# EAGLE design Grove - IMU 9DOF v2.0 (EAGLE 6.4)

## Sheet 1 of 2
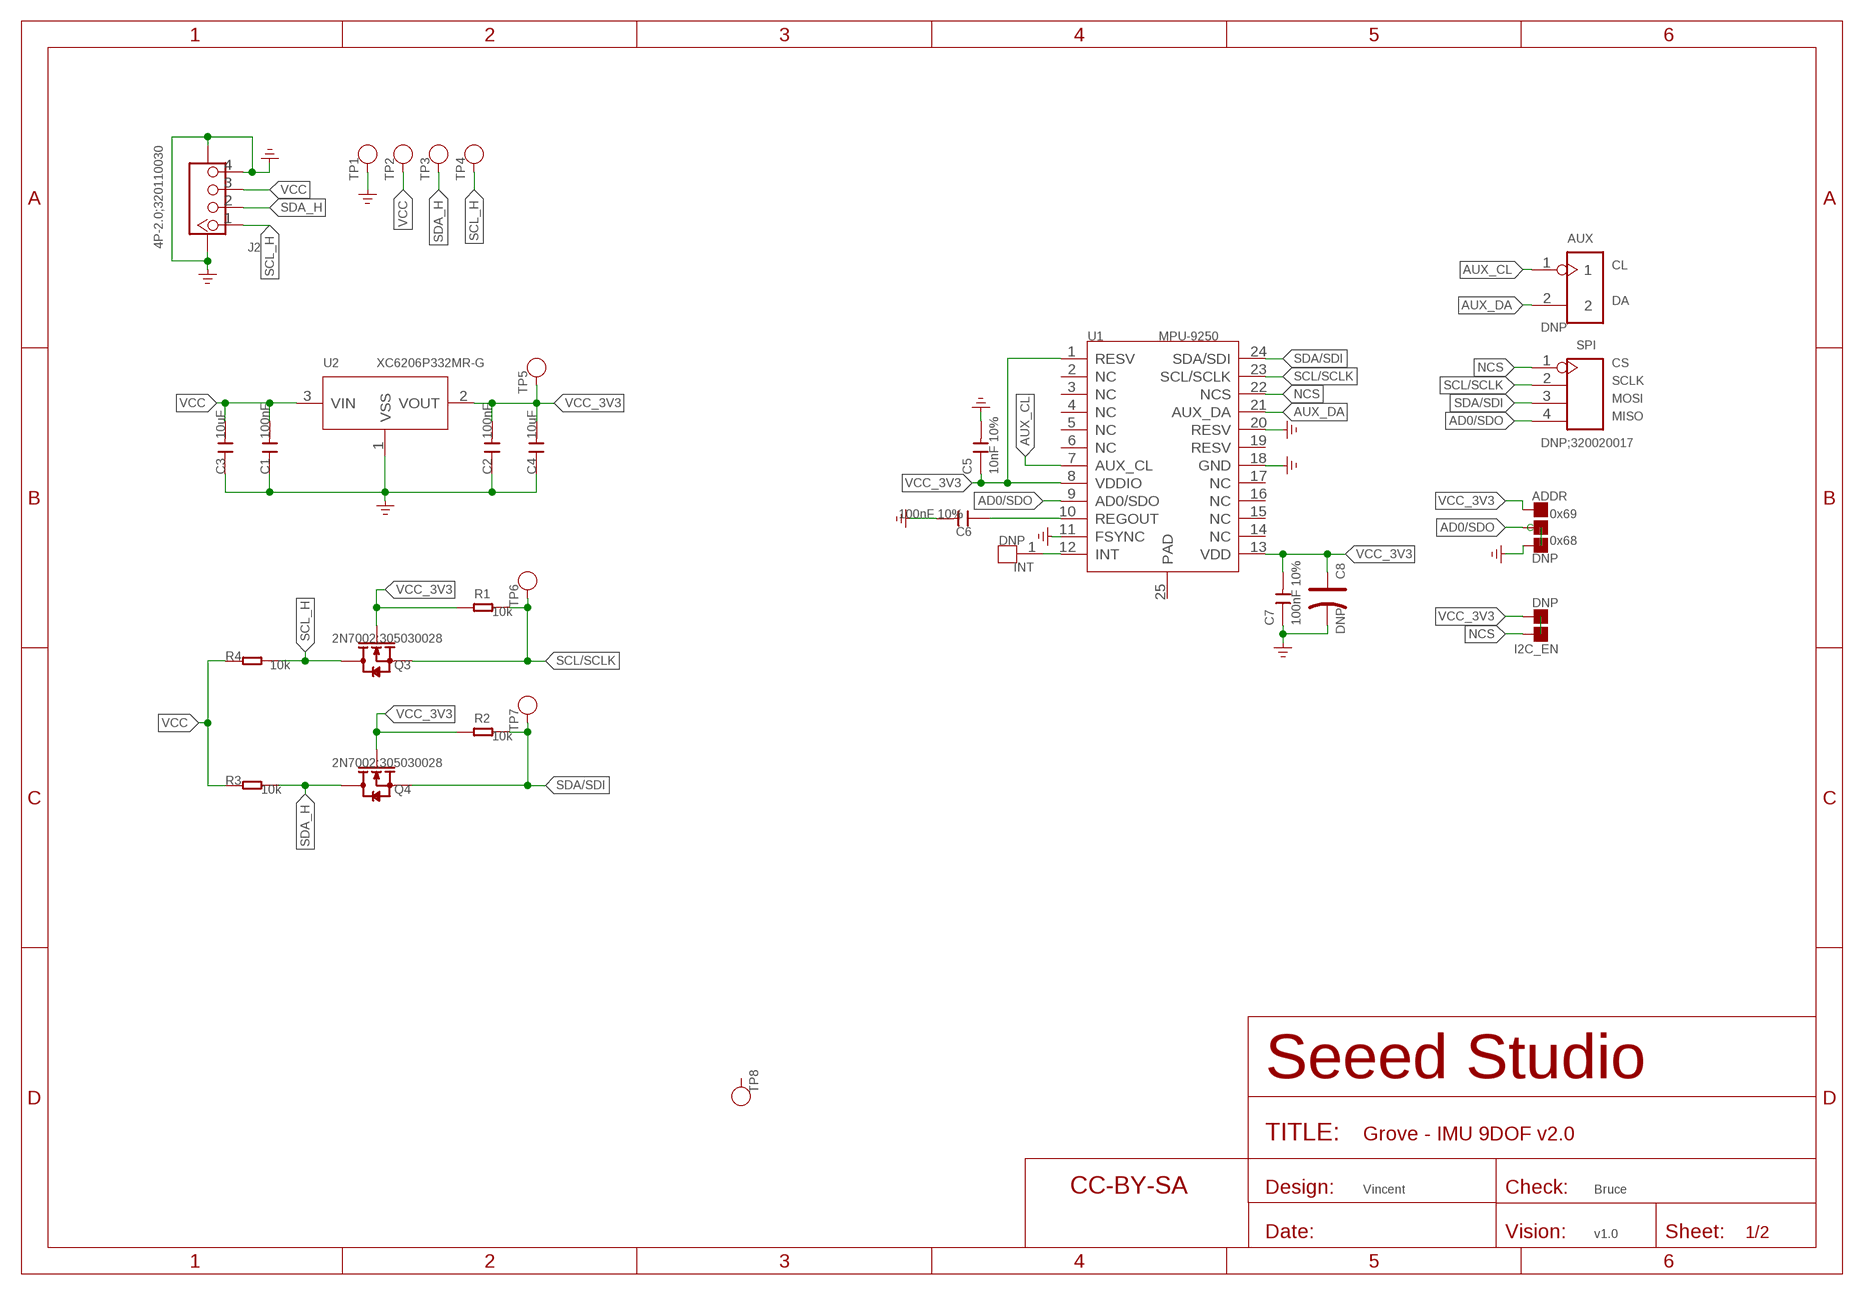
[diagram p0: schematic, sheet 1]

### Parts
ADDR  DNP  PAD-JUMPER-3P-40*40  [3P-SMD-L4.1*W1.5MM]
AUX  DNP  HEADER-2P-65/35MIL  [2P-2.54-65/35MIL]
C1  100nF  CAP-0603  [C0603]
C2  100nF  CAP-0603  [C0603]
C3  10uF  CAP-0805  [C0805]
C4  10uF  CAP-0805  [C0805]
C5  10nF 10%  CAP-0603  [C0603]
C6  100nF 10%  CAP-0603  [C0603]
C7  100nF 10%  CAP-0603  [C0603]
C8  DNP  CAP-POLAR-AVX-A  [AVX-A]
I2C_EN  DNP  PAD-JUMPER-2P  [2P-SMD-L1.78*W1.27MM]
INT  DNP  HEADER-1P-35  [1P-65/35MIL]
J2  4P-2.0;320110030  GROVE-CONNECTOR-SMD'DD'  [4P-SMD-2.0]
Q3  2N7002;305030028  MOSFET-N'SOT23'  [SOT-23]
Q4  2N7002;305030028  MOSFET-N'SOT23'  [SOT-23]
R1  10k  RES-0603  [R0603]
R2  10k  RES-0603  [R0603]
R3  10k  RES-0603  [R0603]
R4  10k  RES-0603  [R0603]
SPI  DNP;320020017  HEADER-4P-65/35MIL  [4P-2.54-65/35MIL]
TP1  DNP  PAD-TEST-POINT'4545'  [TP-D45MIL]
TP2  DNP  PAD-TEST-POINT'4545'  [TP-D45MIL]
TP3  DNP  PAD-TEST-POINT'4545'  [TP-D45MIL]
TP4  DNP  PAD-TEST-POINT'4545'  [TP-D45MIL]
TP5  DNP  PAD-TEST-POINT'4545'  [TP-D45MIL]
TP6  DNP  PAD-TEST-POINT'4545'  [TP-D45MIL]
TP7  DNP  PAD-TEST-POINT'4545'  [TP-D45MIL]
TP8  DNP  PAD-TEST-POINT'4545'  [TP-D45MIL]
U1  MPU-9250  [LEAD-QFN24]
U2  XC6206P332MR-G  PMIC-XC6206PMR  [SOT-23]
U$1  SEEEDSTUDIO-OPEN-SCH-FRAME  [SEEEDSTUDIO-PCB-FRAME]

### Nets
AD0/SDO: ADDR.MM(C) SPI.4 U1.9(AD0/SDO)
AUX_CL: AUX.1 U1.7(AUX_CL)
AUX_DA: AUX.2 U1.21(AUX_DA)
GND: ADDR.11(R) C1.1 C2.1 C3.1 C4.1 C5.2 C6.2 C7.1 C8.- J2.4 J2.SS1 J2.SS2 TP1.T U1.11(FSYNC) U1.18(GND) U1.20(RESV) U2.1(VSS) ; supply symbol labelled GND_POWER
N$3: C6.1 U1.10(REGOUT)
N$4: INT.1 U1.12(INT)
NCS: I2C_EN.2 SPI.1 U1.22(NCS)
SCL/SCLK: Q3.2(S) R1.2 SPI.2 TP6.T U1.23(SCL/SCLK)
SCL_H: J2.1 Q3.3(D) R4.2 TP4.T
SDA/SDI: Q4.2(S) R2.2 SPI.3 TP7.T U1.24(SDA/SDI)
SDA_H: J2.2 Q4.3(D) R3.2 TP3.T
VCC: C1.2 C3.2 J2.3 R3.1 R4.1 TP2.T U2.3(VIN)
VCC_3V3: ADDR.00(L) C2.2 C4.2 C5.1 C7.2 C8.+ I2C_EN.1 Q3.1(G) Q4.1(G) R1.1 R2.1 TP5.T U1.1(RESV) U1.8(VDDIO) U1.13(VDD) U2.2(VOUT)
Unconnected: TP8.T U1.2(NC) U1.3(NC) U1.4(NC) U1.5(NC) U1.6(NC) U1.14(NC) U1.15(NC) U1.16(NC) U1.17(NC) U1.19(RESV) U1.25(PAD)

### Notes on the sheet
- CL
- DA
- CS
- SCLK
- MOSI
- MISO
- 0x69
- 0x68
- Vincent | Bruce
- v1.0

## Sheet 2 of 2

## Library data of the parts
ADDR = Discrete-new:PAD-JUMPER-3P; PARTNO: DNP
AUX = Connector-new:HEADER-2P
C1-C7 = Discrete-new:CAP: Ceramic Capacitors
C8 = Discrete-new:CAP-POLAR: Electrolytic Capacitors,Tantalum Capacitors and Super Capacitors
I2C_EN = Discrete-new:PAD-JUMPER-2P; PARTNO: DNP
INT = Connector-new:HEADER-1P
J2 = Connector-new:GROVE-CONNECTOR-SMD: 4P-SMD-2.0:320110030;4P-SMD-2.0-90D:320110032
Q3 Q4 = Discrete-new:MOSFET-N: IRLL014: http://www.vishay.com/docs/91319/sihll014.pdf
R1-R4 = Discrete-new:RES
SPI = Connector-new:HEADER-4P
TP1-TP8 = Discrete-new:PAD-TEST-POINT; PARTNO: DNP
U1 = template:MPU-9250
U2 = IC-new:PMIC-XC6206P: LOW ESR Cap.Compatible Positive Voltage Regulators
U$1 = moudle-new:SEEEDSTUDIO-OPEN-SCH-FRAME

## Board
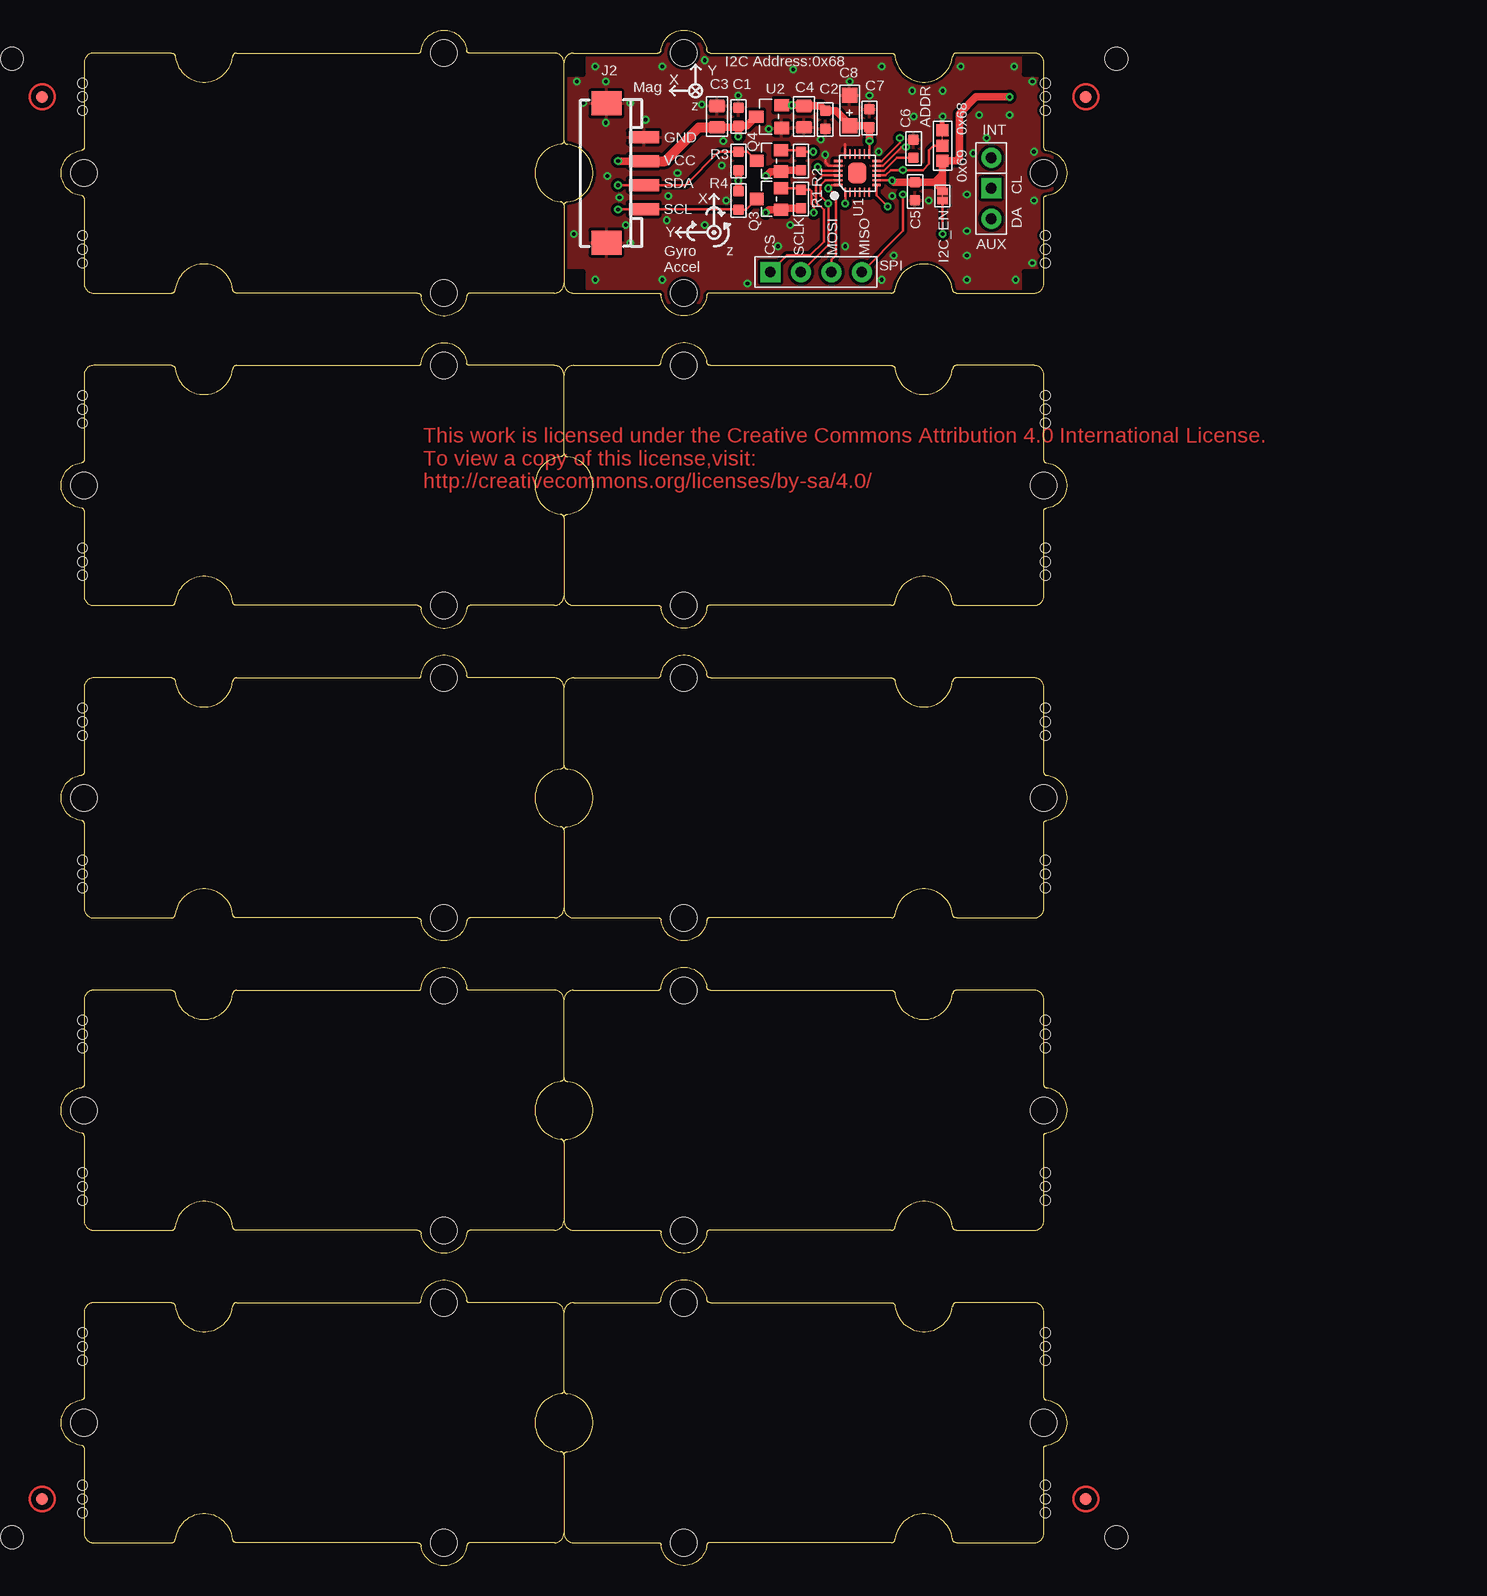
[diagram p1: board, top side]
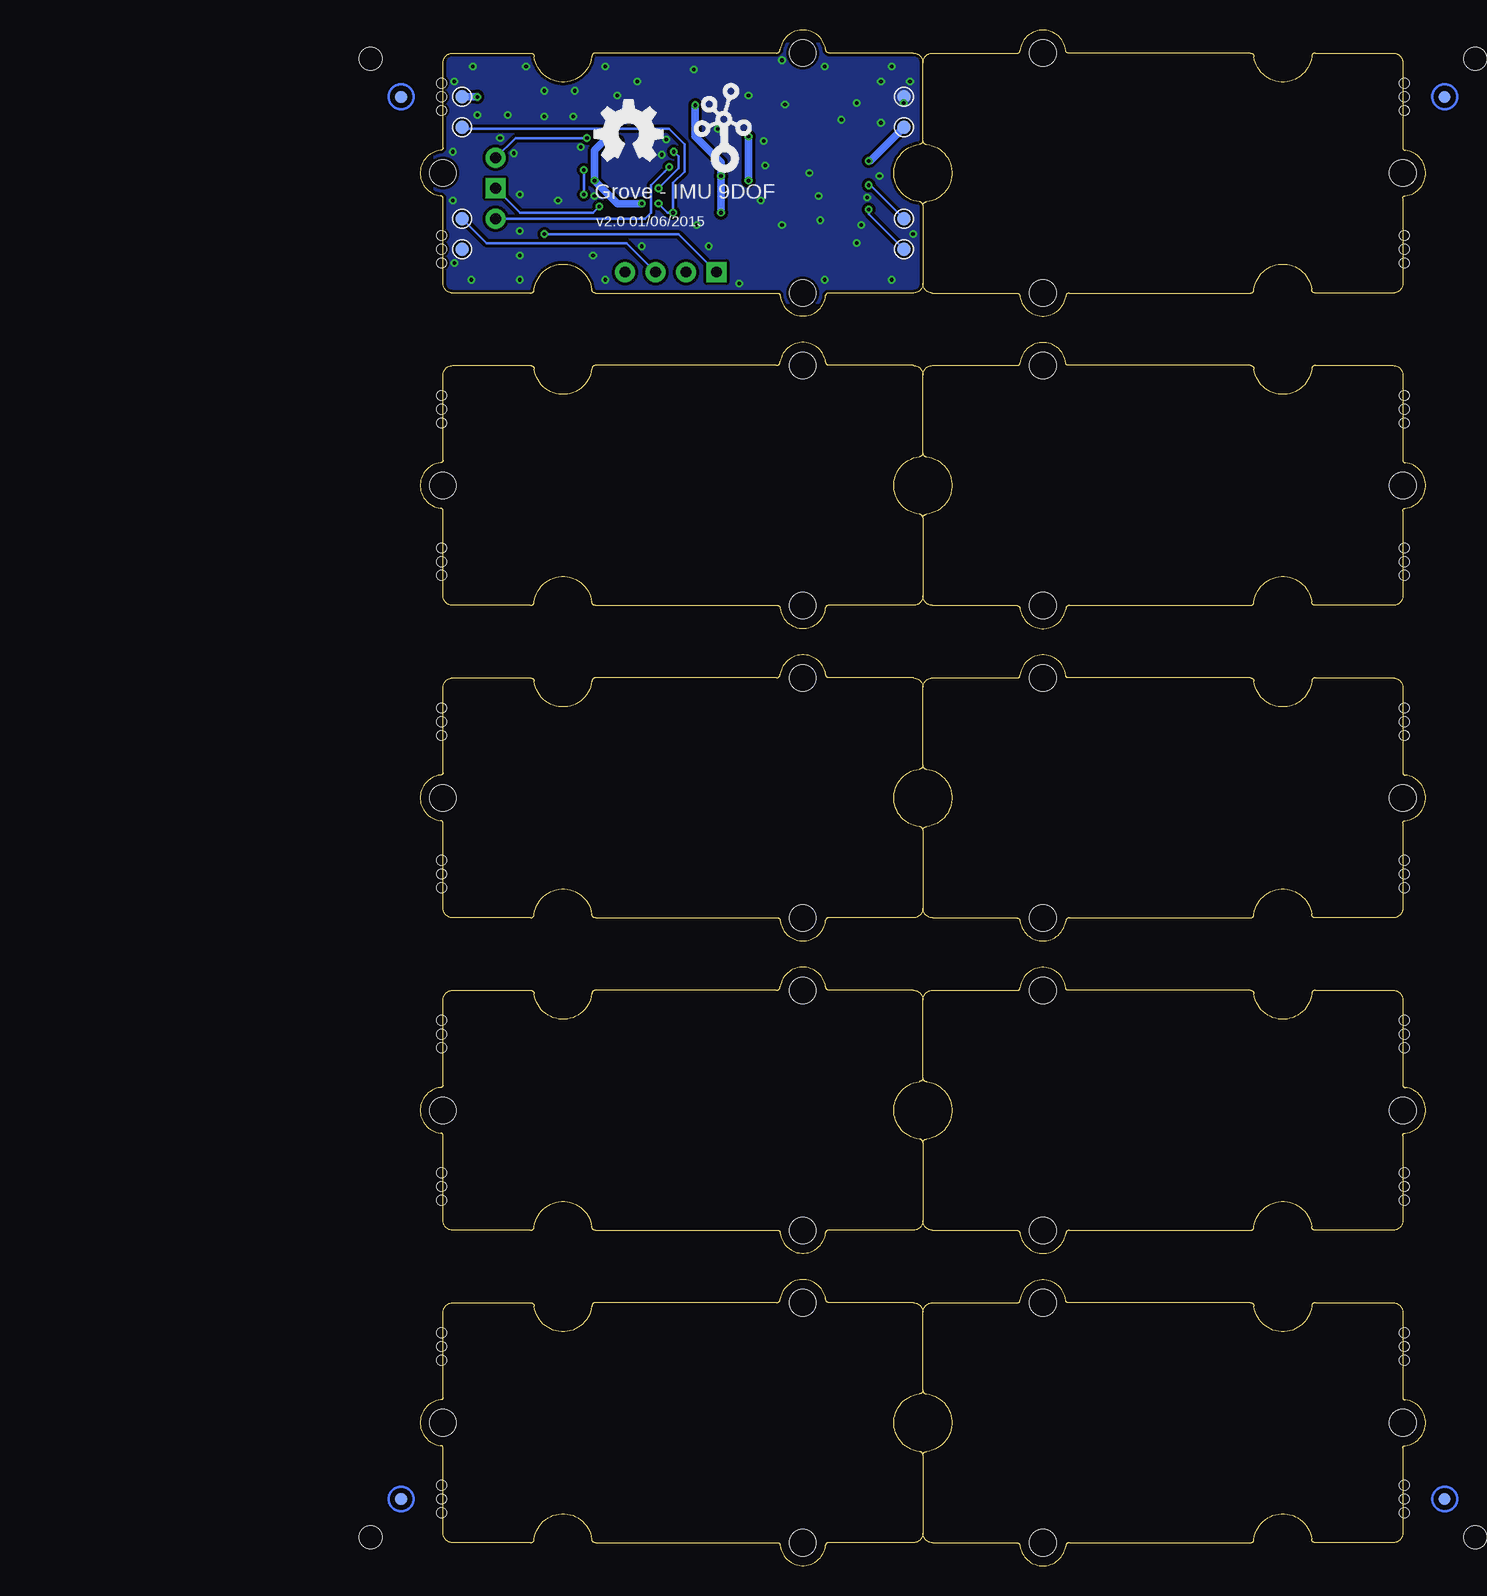
[diagram p2: board, bottom side, seen from below]

Size 83.82 x 127.98 mm. Coordinates in mm from the lower left corner, seen from the top.
Copper layers (1*16): Top 0.035mm / dielectric 1.5mm / Bottom 0.035mm
Design rules "SeeedStudio_2layer_DRU_no_angle_20140221 *": minimum track width 4mil, minimum drill 12mil, track to track 6mil, track to pad 6mil, pad to pad 6mil, via to via 6mil, smd to smd 0mil, copper to edge 10mil, drill to drill 10mil, minimum pad ring 10mil, minimum via ring 6mil, stop-mask expansion 2mil, vias tented up to drill 25mil, thermal gap 10mil
Holes 0.8 mm at 1.78,123.55 1.78,121.27 1.78,122.41 1.78,110.85 1.78,108.57 1.78,109.71 1.78,97.52 1.78,95.23 1.78,96.38 1.78,84.82 1.78,82.53 1.78,83.68 1.78,71.48 1.78,69.2 1.78,70.34 1.78,58.78 1.78,56.5 1.78,57.64 1.78,45.45 1.78,43.16 1.78,44.31 1.78,32.75 1.78,30.46 1.78,31.61 1.78,19.41 1.78,17.13 1.78,18.27 1.78,6.71 1.78,4.43 1.78,5.57 82.04,121.27 82.04,123.55 82.04,122.41 82.04,108.57 82.04,110.85 82.04,109.71 82.04,95.23 82.04,97.52 82.04,96.38 82.04,82.53 82.04,84.82 82.04,83.68 82.04,69.2 82.04,71.48 82.04,70.34 82.04,56.5 82.04,58.78 82.04,57.64 82.04,43.16 82.04,45.45 82.04,44.31 82.04,30.46 82.04,32.75 82.04,31.61 82.04,17.13 82.04,19.41 82.04,18.27 82.04,4.43 82.04,6.71 82.04,5.57
Holes 1.91 mm at -4.13,2.4 87.95,2.4 87.95,125.59 -4.13,125.59

### Footprints (pad centres in the part's own frame; a part is rotated, then mirrored left to right if it is on the bottom)
3P-SMD-L4.1*W1.5MM = smd 1.016 x 1.016: 00 -1.27,0; 11 1.27,0; MM 0,0
2P-2.54-65/35MIL = drill 0.889 pad 1.651 square: 1 0,1.27 | drill 0.889 pad 1.651: 2 0,-1.27
C0603 = smd 0.889 x 0.889: 1 0,0.762; 2 0,-0.762
C0805 = smd 1.397 x 1.016: 1 0,0.889; 2 0,-0.889
AVX-A = smd 1.27 x 1.27: + -1.27,0; - 1.27,0
2P-SMD-L1.78*W1.27MM = smd 0.889 x 0.61: 1 0,0.381; 2 0,-0.381
1P-65/35MIL = drill 0.889 pad 1.651: 1 0,0
4P-SMD-2.0 = smd 1 x 2.5: 1 -3,0; 2 -1,0; 3 1,0; 4 3,0 | smd 2 x 2.5: SS1 -5.8,3.123; SS2 5.8,3.123
ROUND-MARK-1.0 = smd 1.016 x 1.016: P$1 0,0
SOT-23 = smd 1.016 x 1.143: 1 -0.889,-1.016; 2 0.889,-1.016; 3 0,1.016
R0603 = smd 0.889 x 0.889: 1 0,0.762; 2 0,-0.762
4P-2.54-65/35MIL = drill 0.889 pad 1.651 square: 1 0,3.81 | drill 0.889 pad 1.651: 2 0,1.27; 3 0,-1.27; 4 0,-3.81
TP-D45MIL = smd 1.143 x 1.143: T 0,0
LEAD-QFN24 = smd 0.8 x 0.2: 1 -1.6,1; 2 -1.6,0.6; 3 -1.6,0.2; 4 -1.6,-0.2; 5 -1.6,-0.6; 6 -1.6,-1; 13 1.6,-1; 14 1.6,-0.6; 15 1.6,-0.2; 16 1.6,0.2; 17 1.6,0.6; 18 1.6,1 | smd 0.2 x 0.8: 7 -1,-1.6; 8 -0.6,-1.6; 9 -0.2,-1.6; 10 0.2,-1.6; 11 0.6,-1.6; 12 1,-1.6; 19 1,1.6; 20 0.6,1.6; 21 0.2,1.6; 22 -0.2,1.6; 23 -0.6,1.6; 24 -1,1.6 | smd 1.7 x 1.54: 25 0,0
SOT-23' = smd 1.016 x 1.2: 1 -0.95,-1.06; 2 0.95,-1.06; 3 0,1.06
GROVE-TEST-PLATFORM = hole 2.2: -10,-10; -10,10; 20,0
GROVE-1*2-TEST-PLATFORM = hole 2.2: -10,-10; -10,10; 20,0

### Placement (x,y rotation side)
ADDR  73.47,118.35 90 top
AUX  77.53,113.52 0 top
C1  56.45,120.76 0 top
C2  63.69,120.51 180 top
C3  54.67,120.76 0 top
C4  61.91,120.76 180 top
C5  71.18,114.54 0 top
C6  71.06,118.09 180 top
C7  67.37,120.63 0 top
C8  65.72,121.27 90 top
I2C_EN  73.47,114.16 0 top
INT  77.53,117.33 0 top
J2  48.58,116.06 90 top
P1  [ROUND-MARK-1.0]  -1.59,5.57 0 top
P2  [ROUND-MARK-1.0]  85.41,5.57 0 top
P3  [ROUND-MARK-1.0]  -1.59,122.41 0 top
P4  [ROUND-MARK-1.0]  85.41,122.41 0 top
P5  [ROUND-MARK-1.0]  -1.59,5.57 0 bottom
P6  [ROUND-MARK-1.0]  85.41,5.57 0 bottom
P7  [ROUND-MARK-1.0]  85.41,122.41 0 bottom
P8  [ROUND-MARK-1.0]  -1.59,122.41 0 bottom
Q3  58.99,113.9 90 top
Q4  58.99,117.08 90 top
R1  61.66,113.9 180 top
R2  61.66,117.08 180 top
R3  56.45,117.08 180 top
R4  56.45,113.78 0 top
SPI  62.93,107.81 90 top
TP1  43.5,122.41 90 bottom
TP2  43.5,119.87 90 bottom
TP3  43.5,112.25 90 bottom
TP4  43.5,109.71 90 bottom
TP5  80.33,122.41 90 bottom
TP6  80.33,119.87 90 bottom
TP7  80.33,112.25 90 bottom
TP8  80.33,109.71 0 bottom
U1  66.36,116.06 90 top
U2  XC6206P332MR-G  [SOT-23']  58.99,120.76 90 top
U3  [GROVE-TEST-PLATFORM]  61.91,37.96 0 top
U4  [GROVE-TEST-PLATFORM]  21.91,37.96 180 top
U5  [GROVE-TEST-PLATFORM]  61.91,63.99 0 top
U6  [GROVE-TEST-PLATFORM]  21.91,63.99 180 top
U7  [GROVE-TEST-PLATFORM]  61.91,90.03 0 top
U8  [GROVE-TEST-PLATFORM]  21.91,90.03 180 top
U9  [GROVE-TEST-PLATFORM]  21.91,116.06 180 top
U10  [GROVE-TEST-PLATFORM]  61.91,116.06 0 top
U11  [GROVE-TEST-PLATFORM]  61.91,11.92 0 top
U12  [GROVE-TEST-PLATFORM]  21.91,11.92 180 top
U$1  30.16,89.77 0 top
U$12  [GROVE-1*2-TEST-PLATFORM]  61.91,116.06 0 top
U$15  [GROVE-SILK-BIG]  58.48,117.08 0 bottom
U$16  [OSHW_FILLX200_NOTEXT]  69.28,117.08 0 bottom

### Tracks (layer width: path | path; a pad name or v marks a point on that pad's centre or on a via)
AD0/SDO  (via drill 0.3 pad 0.64)
  Top 0.102: ADDR.MM 73.47,119.49
  Top 0.203: ADDR.MM 72.71,118.35 72.33,117.97 72.33,116.82 71.82,116.32 v70.17,116.32 69.15,116.32 68.7,115.86 U1.9 | v70.17,114.28 70.17,111.24 SPI.4
  Bottom 0.203: v70.17,116.32 v70.17,114.28
AUX_CL  (via drill 0.3 pad 0.64)
  Top 0.203: U1.7 67.96,114.21 v68.9,113.27
  Bottom 0.203: AUX.1 75.5,112.76 69.41,112.76 v68.9,113.27
AUX_DA  (via drill 0.3 pad 0.64)
  Top 0.203: U1.21 63.36,116.26 v63.06,116.57
  Bottom 0.203: AUX.2 65.09,112.25 64.58,112.76 64.58,115.05 63.44,116.19 v63.06,116.57
GND  (via drill 0.3 pad 0.64)
  Top 0.203: U1.11 68.48,116.66 70.04,118.22 v70.42,118.22 | U1.20 63.98,116.66 63.69,116.95 v63.69,117.59 | 65.35,118.47 65.35,117.7
  Top 0.406: ADDR.11 v73.47,120.76
  other vias: 44.51,124.95 63.31,118.86 58.99,119.74 71.06,120.76 53.66,125.46 65.72,123.68 47.05,111.74 57.21,106.85 72.33,113.78 75.5,107.17 55.06,116.7 50.1,107.17 50.1,124.95 61.02,124.7 68.39,124.95 80.96,108.57 81.09,113.78 81.09,117.84 79.44,124.95 74.99,124.95 42.99,123.68 45.53,115.81 46.55,114.03 42.74,110.98 44.51,107.17 53.66,111.74 60.77,111.74 59.75,109.97 65.34,109.97 68.39,107.17 69.41,109.2 75.5,109.2 75.5,111.24 75.5,114.28 77.15,118.98 70.93,122.92 73.47,122.92 50.61,114.16 50.48,112.12 79.57,107.17 76.01,117.71 76.52,120.89 79.06,120.89 80.96,123.68 53.4,121.78 56.45,122.54 67.37,122.54 45.4,120.25 45.4,123.68 43.5,121.9 47.44,121.9 48.71,120.51 51.37,116.06 55.18,118.73 47.44,110.22 68.14,117.84 69.28,114.16 55.44,113.78
  pour Bottom (isolate 0.254, rank 6): 41.34,126.86 82.61,126.86 82.61,105.27 41.34,105.27
  pour Top (isolate 0.254, rank 6): 41.34,126.86 82.61,126.86 82.61,105.27 41.34,105.27
N$3
  Top 0.203: C6.1 69.66,117.33 68.59,116.26 U1.10
N$4  (via drill 0.3 pad 0.64)
  Top 0.203: U1.12 68.37,117.06 69.91,118.6 v69.91,118.98
  Bottom 0.203: v69.91,118.98 75.88,118.98 INT.1
NCS  (via drill 0.3 pad 0.64)
  Top 0.102: I2C_EN.2 73.47,114.54
  Top 0.203: U1.22 63.49,115.86 62.93,115.3 62.93,113.65 63.56,113.01 63.56,110.35 62.42,109.2 60.52,109.2 SPI.1 | I2C_EN.2 v73.47,110.98
  Bottom 0.203: v73.47,110.98 62.29,110.98 SPI.1
SCL/SCLK  (via drill 0.3 pad 0.64)
  Top 0.203: U1.23 63.73,115.46 63.31,115.05 63.31,114.16 v63.95,113.52 63.95,110.09 SPI.2 | Q3.2 61.53,114.79 R1.2 | R1.2 61.66,114.6 | v62.74,112.76 62.74,113.33 62.55,113.52 62.55,114.54 62.42,114.66 R1.2
  Bottom 0.203: TP6.T 80.2,119.74 63.06,119.74 61.79,118.47 61.79,116.19 62.74,115.24 v62.74,112.76 63.18,112.76 v63.95,113.52
SCL_H  (via drill 0.3 pad 0.64)
  Top 0.203: v46.42,113.01 46.47,113.06 J2.1 56.4,113.06 R4.2 57.09,113.01 Q3.3
  Bottom 0.203: v46.42,113.01 46.42,112.63 TP4.T
SDA/SDI  (via drill 0.3 pad 0.64)
  Top 0.203: Q4.2 61.53,117.97 R2.2 v62.68,117.84 | U1.24 64.22,115.06 v63.95,114.79 64.58,114.16 64.58,109.2 64.2,108.82 SPI.3
  Bottom 0.203: v63.95,114.79 62.29,116.44 62.29,117.46 v62.68,117.84 | TP7.T 78.3,110.22 66.61,110.22 SPI.3
SDA_H  (via drill 0.3 pad 0.64)
  Top 0.203: v46.42,115.05 46.44,115.06 J2.2 52.02,115.06 54.8,117.84 R3.2 57.21,117.84 Q4.3
  Bottom 0.203: v46.42,115.05 46.29,115.05 TP3.T
VCC  (via drill 0.3 pad 0.64)
  Top 0.61: C3.2 54.8,119.87 56.33,119.87 C1.2 | C1.2 57.17,120 U2.3 | R4.1 v56.45,115.43 R3.1 | v56.45,119.11 C1.2 | J2.3 46.44,117.06 v46.42,117.08
  Top 0.813: J2.3 50.34,117.06 53.15,119.87 54.8,119.87
  Bottom 0.61: v56.45,115.43 v56.45,119.11 | v46.42,117.08 46.29,117.08 TP2.T
VCC_3V3  (via drill 0.3 pad 0.64)
  Top 0.203: U1.13 67.36,118.71 v67.37,118.73 | U1.8 69.24,115.46 v69.28,115.43 | U1.1 65.36,113.54 v65.34,113.52
  Top 0.61: U2.2 v60.9,121.71 61.85,121.71 C4.2 63.31,121.65 C2.2 64.58,121.27 65.72,120.13 C8.+ 67.25,120 C7.2 v67.37,118.73 | R1.1 60.14,113.14 Q3.1 58.99,113.01 v58.74,112.76 | R2.1 60.14,116.32 Q4.1 59.12,116.19 v58.74,115.81 | v69.28,115.43 69.41,115.3 C5.1 72.84,115.3 | I2C_EN.1 73.47,115.3 | 73.47,115.3 73.47,115.93 | 73.47,115.93 ADDR.00 74.61,117.08 74.87,117.33 74.87,121.01 76.26,122.41 v79.06,122.41 | 72.84,115.3 73.47,115.3 | 72.84,115.3 73.47,115.93 | 72.84,115.3 73.34,114.79
  Bottom 0.61: v58.74,112.76 v58.74,115.81 58.74,116.95 60.9,119.11 v60.9,121.71 | v65.34,113.52 67.37,113.52 v69.28,115.43 69.28,117.97 68.52,118.73 v67.37,118.73 | TP5.T v79.06,122.41

### Text on the board
tPlace: Y | I2C Address:0x68 | Mag | X | z | GND | 0x68 | VCC | SDA | 0x69 | X | CL | SCL | Y | DA | z | CS | SCLK | MOSI | MISO | Gyro / Accel
bPlace: Grove - IMU 9DOF | v2.0 01/06/2015